# Altium schematic sheet Block_Diagram.SchDoc: Block Diagram
size A3; Organization: INTERCREATE; Address1: 2415 3RD ST. SUITE #232; Address2: SAN FRANCISCO CA 94107; SheetNumber: 1; SheetTotal: 2; ProjectName: KAGWERKS COMMAND CENTER
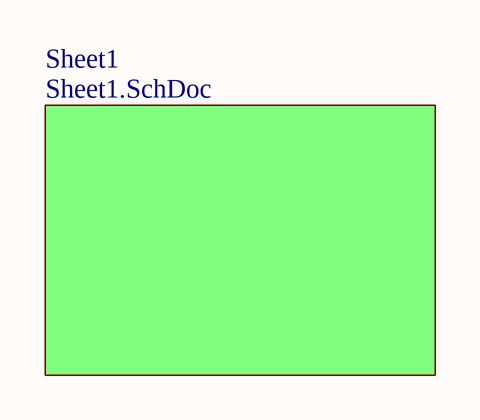
[diagram p0: Block_Diagram.SchDoc]

## Sub-sheets
Sheet1 = Sheet1.SchDoc: no entries

## Notes on the sheet
- Title
- Size:
- Date:
- A3
- Number:
- Time:
- Revision:
- Sheet
- of
- File: